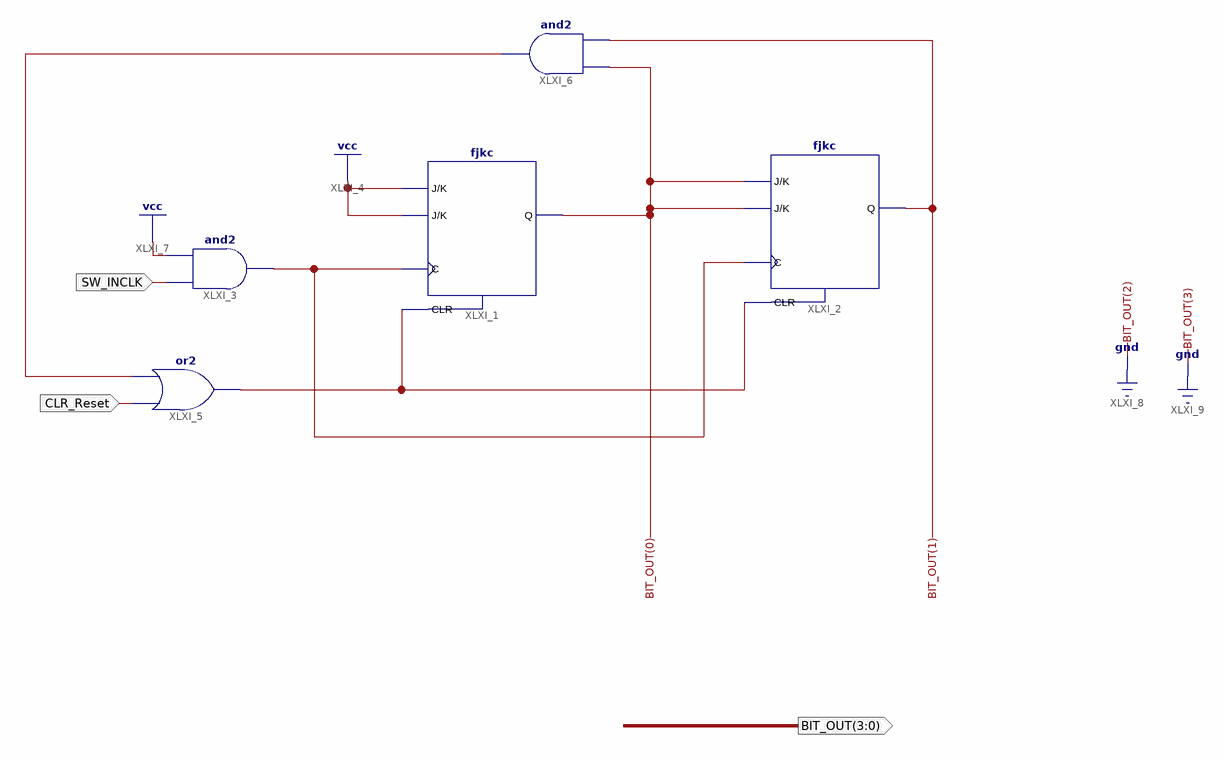
[diagram p0: schematic sheet 1]
// Xilinx ISE schematic Counter0_2_CLR_TC_V2.sch (spartan6) as structural Verilog: 5 symbols, 3 ports
module Counter0_2_CLR_TC_V2 (
  input  SW_INCLK,
  input  CLR_Reset,
  output [3:0] BIT_OUT
);

  wire XLXN_2, XLXN_4, XLXN_10;

  fjkc XLXI_1 (.C(XLXN_4), .CLR(XLXN_2), .J(1'b1), .K(1'b1), .Q(BIT_OUT[0]));
  fjkc XLXI_2 (.C(XLXN_4), .CLR(XLXN_2), .J(BIT_OUT[0]), .K(BIT_OUT[0]), .Q(BIT_OUT[1]));
  and XLXI_3 (XLXN_4, SW_INCLK, 1'b1);
  or XLXI_5 (XLXN_2, CLR_Reset, XLXN_10);
  and XLXI_6 (XLXN_10, BIT_OUT[1], BIT_OUT[0]);

  assign BIT_OUT[3:2] = 2'b00;
endmodule
